# Altium schematic sheet WeeMouse.SchDoc
size A3; SheetNumber: 1; SheetTotal: 1
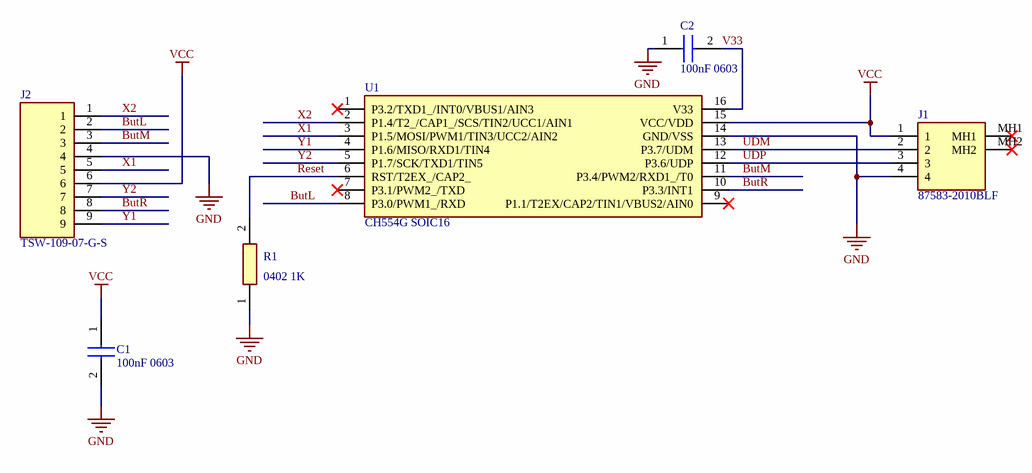
[diagram p0: WeeMouse.SchDoc]

## Parts
C1  100nF 0603  [CAPC1608X90N]
C2  100nF 0603  [CAPC1608X90N]
J1  87583-2010BLF  [875832010BLF]
J2  TSW-109-07-G-S  [TSW-109-XX-YY-S]
R1  0402 1K  [RESC1005X40N]
U1  CH554G SOIC16  [SOIC127P600X175-16N]

## Nets
GND: C1.2 C2.1 J1.4 J2.4 R1.1 U1.14(GND/VSS)
VCC: C1.1 J1.1 J2.6 U1.15(VCC/VDD)
ButL: J2.2 U1.8(P3.0/PWM1_/RXD)
ButM: J2.3 U1.11(P3.4/PWM2/RXD1_/T0)
ButR: J2.8 U1.10(P3.3/INT1)
Reset: R1.2 U1.6(RST/T2EX_/CAP2_)
UDM: J1.2 U1.13(P3.7/UDM)
UDP: J1.3 U1.12(P3.6/UDP)
V33: C2.2 U1.16(V33)
X1: J2.5 U1.3(P1.5/MOSI/PWM1/TIN3/UCC2/AIN2)
X2: J2.1 U1.2(P1.4/T2_/CAP1_/SCS/TIN2/UCC1/AIN1)
Y1: J2.9 U1.4(P1.6/MISO/RXD1/TIN4)
Y2: J2.7 U1.5(P1.7/SCK/TXD1/TIN5)

Not connected (* = marked no-connect by the designer): J1 MH1* MH2*; U1 1(P3.2/TXD1_/INT0/VBUS1/AIN3)* 7(P3.1/PWM2_/TXD)* 9(P1.1/T2EX/CAP2/TIN1/VBUS2/AIN0)*

## Notes on the sheet
- SIZE
- DIMENSIONS
- TITLE
- VARIANT
- REVISION
- DATE
- A3
- SHEET
- OF
- FILE
- DRAWN BY

## Library data of the parts
C1 C2 = 06033C104KAT4A: Capacitor; Manufacturer_Name: AVX; Datasheet Link: http://www.mouser.com/catalog/supplier/library/pdf/AVXSurfaceMountCeramic.pdf; Height: 0.9mm; Manufacturer_Part_Number: 06033C104KAT4A; Mouser Part Number: 581-06033C104KAT4A; Mouser Price/Stock: https://www.mouser.co.uk/ProductDetail/AVX/06033C104KAT4A?qs=8C2chATdSPiv3E9zfPZulg%3D%3D; Arrow Part Number: 06033C104KAT4A; Arrow Price/Stock: https://www.arrow.com/en/products/06033c104kat4a/avx?region=nac
J1 = 87583-2010BLF: Connector; Manufacturer_Name: Amphenol Communications Solutions; Datasheet Link: https://cdn.amphenol-cs.com/media/wysiwyg/files/drawing/87583.pdf; Height: 7.94mm; Manufacturer_Part_Number: 87583-2010BLF; Arrow Part Number: 87583-2010BLF; Arrow Price/Stock: https://www.arrow.com/en/products/87583-2010blf/amphenol-fci?region=europe
J2 = TSW-109-07-G-S: Connector; Manufacturer_Name: SAMTEC; Datasheet Link: http://suddendocs.samtec.com/prints/tsw-xxx-xx-xxx-x-xx-xxx-mkt.pdf; Manufacturer_Part_Number: TSW-109-07-G-S; Mouser Part Number: 200-TSW10907GS; Mouser Price/Stock: https://www.mouser.co.uk/ProductDetail/Samtec/TSW-109-07-G-S?qs=FESYatJ8odKgJbMoqjluRA%3D%3D; Arrow Part Number: TSW-109-07-G-S; Arrow Price/Stock: https://www.arrow.com/en/products/tsw-109-07-g-s/samtec?region=nac
R1 = CRCW04021K00JNED: Resistor; Manufacturer_Name: Vishay; Datasheet Link: http://www.vishay.com/docs/20035/dcrcwe3.pdf; Height: 0.4mm; Manufacturer_Part_Number: CRCW04021K00JNED; Mouser Part Number: 71-CRCW0402J-1.0K-E3; Mouser Price/Stock: https://www.mouser.co.uk/ProductDetail/Vishay-Dale/CRCW04021K00JNED?qs=YX%252BK5oaHNYpGRsHVuzxl1A%3D%3D; Arrow Part Number: CRCW04021K00JNED; Arrow Price/Stock: https://www.arrow.com/en/products/crcw04021k00jned/vishay; LCSC Part #: C279981
U1 = CH544G: 8051 MCU with USB host; Manufacturer_Name: onsemi; Manufacturer_Part_Number: MM74HC4049M